# Altium schematic sheet AutoDoor_App.SchDoc
size A4
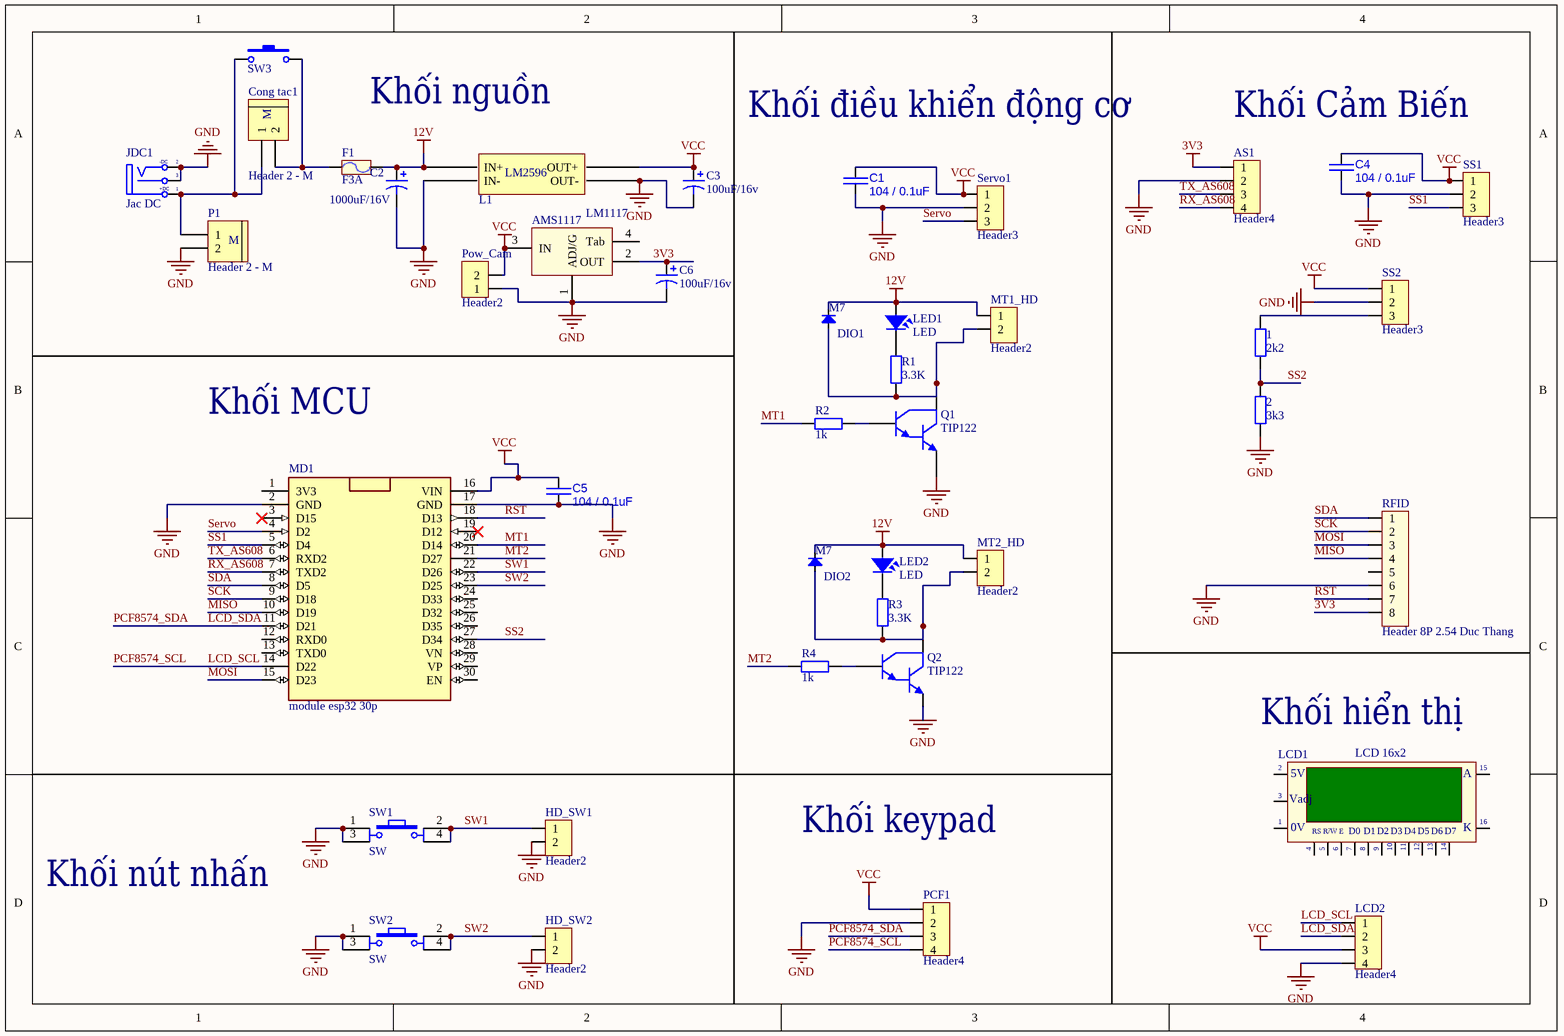
[diagram p0: AutoDoor_App.SchDoc]

## Parts
1  2k2  [DIEN TRO 0805]
2  3k3  [DIEN TRO 0805]
AMS1117  LM1117  [SOT223-4N]
AS1  Header4  [Header4]
C1  value 104 / 0.1uF  [CAP_0805]  (hidden comment: approved sub OK)
C2  1000uF/16V  [C10mm]
C3  100uF/16v  [C5mm]
C4  value 104 / 0.1uF  [CAP_0805]  (hidden comment: approved sub OK)
C5  value 104 / 0.1uF  [CAP_0805]  (hidden comment: approved sub OK)
C6  100uF/16v  [C5mm]
Cong_tac1  Header 2 - M  [Medium - Header 2]
DIO1  M7  [DIO-SMD-106]
DIO2  M7  [DIO-SMD-106]
F1  F3A  [Fuse]
HD_SW1  Header2  [Header2]
HD_SW2  Header2  [Header2]
JDC1  Jac DC  [DC-IN]
L1  BUCK_LM2596  [BUCK_LM2596]  (value not drawn)
LCD1  LCD 16x2  [LCD16X2N]
LCD2  Header4  [XH2.54M-4]
LED1  LED  [LED-5 GRe]
LED2  LED  [LED-5 GRe]
MD1  module esp32 30p  [module esp32 30 pin]
MT1_HD  Header2  [Header2]
MT2_HD  Header2  [Header2]
P1  Header 2 - M  [Medium - Header 2]
PCF1  Header4  [XH2.54M-4]
Pow_Cam  Header2  [Header2]
Q1  TIP122  [QTO-220]
Q2  TIP122  [QTO-220]
R1  3.3K  [DIEN TRO 0805]
R2  1k  [DIEN TRO 0805]
R3  3.3K  [DIEN TRO 0805]
R4  1k  [DIEN TRO 0805]
RFID  Header 8P 2.54 Duc Thang  [XH2.54M-8]
Servo1  Header3  [Header3]
SS1  Header3  [Header3]
SS2  Header3  [Header3]
SW1  SW  [SW4]
SW2  SW  [SW4]
SW3  KCD01-11_SWITCH  [KCD01-11]  (value not drawn)

## Nets
3V3: AMS1117.2(OUT) AS1.1 C6.1 RFID.8
12V: C2.1 DIO1.2(K) DIO2.2(K) F1.2 L1.1(IN+) LED1.1 LED2.1 MT1_HD.1 MT2_HD.1
GND: 2.2 AMS1117.1(ADJ/G) AS1.2 C1.1 C2.2 C3.2 C4.1 C5.1 C6.2 HD_SW1.2 HD_SW2.2 JDC1.2(TN) JDC1.3(S) L1.2(IN-) L1.3(OUT-) LCD2.4 MD1.2(GND) MD1.17(GND) P1.2 PCF1.2 Pow_Cam.1 Q1.3(E) Q2.3(E) RFID.6 Servo1.2 SS1.2 SS2.2 SW1.1 SW1.3 SW2.1 SW2.3
VCC: AMS1117.3(IN) C1.2 C3.1 C4.2 C5.2 L1.4(OUT+) LCD2.3 MD1.16(VIN) PCF1.1 Pow_Cam.2 Servo1.1 SS1.1 SS2.1
LCD_SCL: LCD2.1 MD1.14(D22) PCF1.4  [also labelled PCF8574_SCL]
LCD_SDA: LCD2.2 MD1.11(D21) PCF1.3  [also labelled PCF8574_SDA]
MISO: MD1.10(D19) RFID.4
MOSI: MD1.15(D23) RFID.3
MT1: MD1.20(D14) R2.2
MT2: MD1.21(D27) R4.2
RST: MD1.18(D13) RFID.7
RX_AS608: AS1.4 MD1.7(TXD2)
SCK: MD1.9(D18) RFID.2
SDA: MD1.8(D5) RFID.1
Servo: MD1.4(D2) Servo1.3
SS1: MD1.5(D4) SS1.3
SS2: 1.2 2.1 MD1.27(D34)
SW1: HD_SW1.1 MD1.22(D26) SW1.2 SW1.4
SW2: HD_SW2.1 MD1.23(D25) SW2.2 SW2.4
TX_AS608: AS1.3 MD1.6(RXD2)
Net1_1: 1.1 SS2.3
NetCong_tac1_1: Cong_tac1.1 JDC1.1(T) P1.1 SW3.1
NetCong_tac1_2: Cong_tac1.2 F1.1 SW3.2
NetDIO1_1: DIO1.1(A) MT1_HD.2 Q1.2(C) R1.2
NetDIO2_1: DIO2.1(A) MT2_HD.2 Q2.2(C) R3.2
NetLED1_2: LED1.2 R1.1
NetLED2_2: LED2.2 R3.1
NetQ1_1: Q1.1(B) R2.1
NetQ2_1: Q2.1(B) R4.1

Not connected (* = marked no-connect by the designer): AMS1117 4(Tab); LCD1 1(GND) 2(VDD) 3(VAdj) 4(RS) 5(R/~{W}) 6(~{EN}) 7(D0) 8(D1) 9(D2) 10(D3) 11(D4) 12(D5) 13(D6) 14(D7) 15(A) 16(K); MD1 1(3V3) 3(D15)* 12(RXD0) 13(TXD0) 19(D12)* 24(D33) 25(D32) 26(D35) 28(VN) 29(VP) 30(EN); RFID 5

## Notes on the sheet
- Khối nguồn
- Khối điều khiển động cơ
- Khối Cảm Biến
- Khối MCU
- (near LCD1) Khối hiển thị
- Khối keypad
- Khối nút nhấn
- (in symbol BUCK_LM2596) LM2596
- (in symbol DCIN) -DC; +DC
- (in symbol Header 2 - M) M
- (in symbol LCD) 5V; Vadj; |; 0V; R/W; E

## Library data of the parts
1 2 R1-R4 = R0805: Resistor SMD 0805; Published: 8-Jun-2000; LatestRevisionDate: 17-Jul-2002; LatestRevisionNote: Re-released for DXP Platform.; PackageReference: AXIAL-0.4; Publisher: Altium Limited
AMS1117 = LM1117: 3v3; Value: LM317
AS1 LCD2 PCF1 = Header4: Header IDC, 4 x 1 Pin Vertical 2.54mm Pitch (Non-Boxed, Male); Manufacturer: W¨¹rth Elektronik eiSos GmbH; partNo: 613002143121; ComponentLink1 Description: Manufacturer; ComponentLink2 Description: Datasheet; NoPins: 02; Created Date: 29 March 2013; ComponentLink1URL: http://www.we-online.com; ComponentLink2URL: http://katalog.we-online.de/em/datasheet/6130xx143121.pdf; Created by: Karrer Zheng
C1 C4 C5 = CAP C_0805: Capacitor SMD Cer 1.8nF 10% 50V X7R 0805; Manufacturer 1: AVX Corporation; Manufacturer Part Number 1: 08055C182KAT2A; Ratings: 50V; X7R; SCDType: source*; Tolerance: ±10%; Operating Temperature: -55°C ~ 125°C; Package / Case: 0805 (2012 metric); Supplier 1: Digi-Key; Supplier Part Number 1: 478-1374-1-ND
C2 = Cap Pol 12mm: Polarized Capacitor (Axial); Published: 8-Jun-2000; LatestRevisionDate: 17-Jul-2002; LatestRevisionNote: Re-released for DXP Platform.; PackageReference: POLAR0.8; Publisher: Altium Limited
C3 C6 = Cap Pol 5mm: Polarized Capacitor (Axial); Published: 8-Jun-2000; LatestRevisionDate: 17-Jul-2002; LatestRevisionNote: Re-released for DXP Platform.; PackageReference: POLAR0.8; Publisher: Altium Limited
Cong_tac1 P1 = Header 2 - M: Header, 2-Pin, Medium; LatestRevisionDate: 17-Jul-2002; LatestRevisionNote: Re-released for DXP Platform.; Publisher: Altium Limited
DIO1 DIO2 = Diode SMD: Default Diode; Code - JEDEC: DO-214-AB; Value: 1N5007; Published: 8-Jun-2000; Revision: July-2002: Re-released for DXP Platform.; Publisher: Altium Limited
F1 = Fuse: Designed by: VanDungEvn; Value: Fuse
HD_SW1 HD_SW2 MT1_HD MT2_HD Pow_Cam = Header2: Header IDC, 2 x 1 Pin Vertical 2.54mm Pitch (Non-Boxed, Male); Manufacturer: W¨¹rth Elektronik eiSos GmbH; partNo: 613002143121; ComponentLink1 Description: Manufacturer; ComponentLink2 Description: Datasheet; NoPins: 02; Created Date: 29 March 2013; ComponentLink1URL: http://www.we-online.com; ComponentLink2URL: http://katalog.we-online.de/em/datasheet/6130xx143121.pdf; Created by: Karrer Zheng
JDC1 = DCIN: Jac DC input; Value: Jac DC
LCD1 = LCD
LED1 LED2 = LED: LED Single colour Green and Red; Value: LED 3 ly Single Colour
Q1 Q2 = TIP122: Darlington Silicon Power NPN Transistor, 8 Amp, 100 Volts and 65 Watts
RFID = Header 8P 2.54 Duc Thang: Cắm; Ten_Linh_Kien: Header 8P XH2.54-8P Đực Thẳng; Don_Vi: Con; Ma_Hang: MH003366; Chung_Loai: Cắm
Servo1 SS1 SS2 = Header3: Header IDC, 3 x 1 Pin Vertical 2.54mm Pitch (Non-Boxed, Male); Manufacturer: W¨¹rth Elektronik eiSos GmbH; partNo: 613002143121; ComponentLink1 Description: Manufacturer; ComponentLink2 Description: Datasheet; NoPins: 02; Created Date: 29 March 2013; ComponentLink1URL: http://www.we-online.com; ComponentLink2URL: http://katalog.we-online.de/em/datasheet/6130xx143121.pdf; Created by: Karrer Zheng
SW1 SW2 = SW4: Switch button 4 pin; Value: Button chip 4 pin
SW3 = KCD01-11_SWITCH: Nut Nhan 2 Chan SMD 3x6x2.5; Ma_Hang: MH001036; Ten: Nút Nhấn 2 Chân 3x6x2.5MM SMD